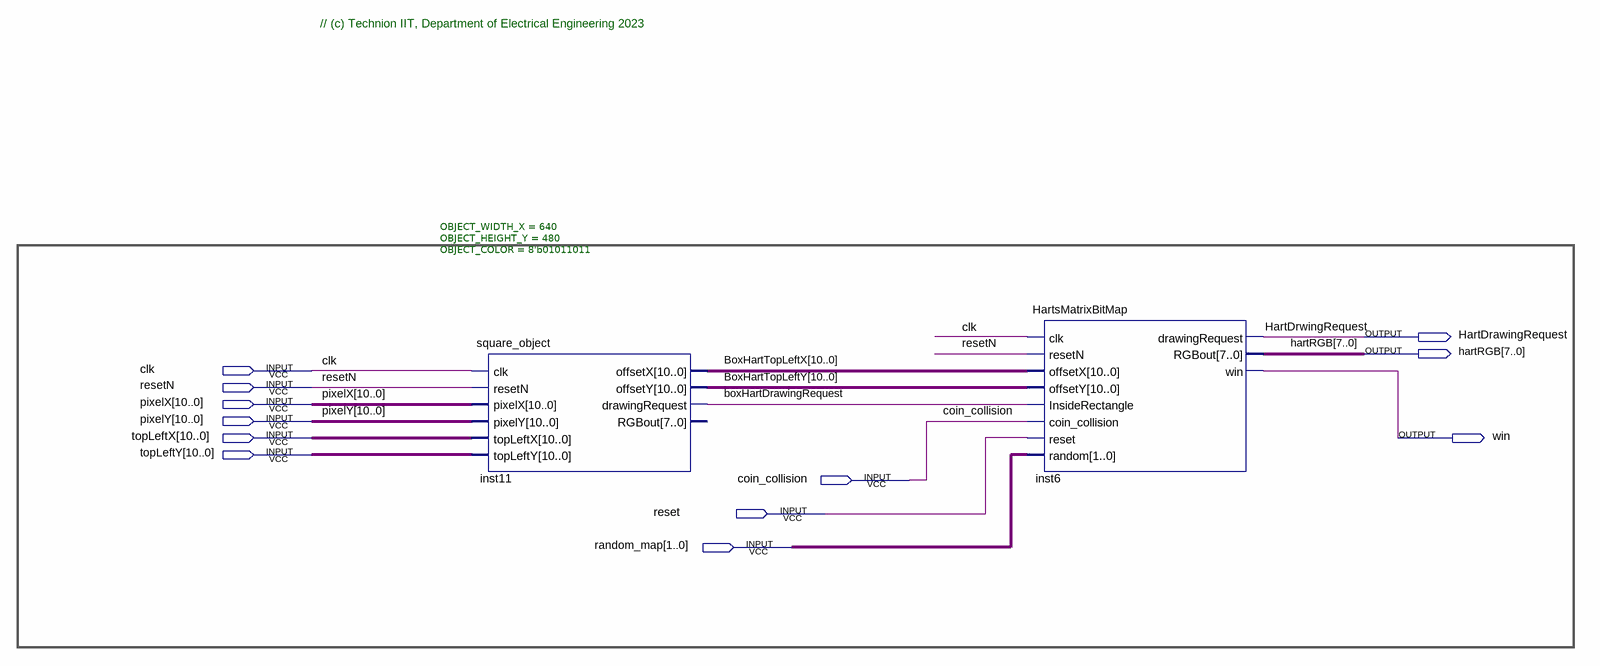
[diagram p0: schematic sheet]
// Quartus schematic HART_DISPLAY.bdf as structural Verilog: 2 symbols, 12 pins
module HART_DISPLAY (
  input  clk,
  input  resetN,
  input  [10:0] pixelX,
  input  [10:0] pixelY,
  input  [10:0] topLeftX,
  input  [10:0] topLeftY,
  input  coin_collision,
  input  reset,
  input  [1:0] random_map,
  output HartDrawingRequest,
  output [7:0] hartRGB,
  output win
);

  wire boxHartDrawingRequest;
  wire [10:0] BoxHartTopLeftX, BoxHartTopLeftY;

  square_object #(.OBJECT_WIDTH_X(640), .OBJECT_HEIGHT_Y(480), .OBJECT_COLOR(8'b01011011)) inst11 (
    .clk(clk), .resetN(resetN), .pixelX(pixelX), .pixelY(pixelY), .topLeftX(topLeftX), .topLeftY(topLeftY),
    .offsetX(BoxHartTopLeftX), .offsetY(BoxHartTopLeftY), .drawingRequest(boxHartDrawingRequest));  // open: RGBout
  HartsMatrixBitMap inst6 (
    .clk(clk), .resetN(resetN), .offsetX(BoxHartTopLeftX), .offsetY(BoxHartTopLeftY),
    .InsideRectangle(boxHartDrawingRequest), .coin_collision(coin_collision), .reset(reset),
    .random(random_map), .drawingRequest(HartDrawingRequest), .RGBout(hartRGB), .win(win));

  // Other names for the same wires on the sheet: HartDrwingRequest = HartDrawingRequest

  // Notes on the sheet:
  //   // (c) Technion IIT, Department of Electrical Engineering 2023
endmodule
